# Altium schematic sheet Mechanical_Parts.SchDoc: Mechanical_Parts
size A4; Date: Not used; ApprovedBy: Not used; CheckedBy: Not used; Author: Not used; CompanyName: STMicroelectronics; DrawnBy: Not used; Engineer: Not used; Organization: Not used; Address1: Not used; Address2: Not used; Address3: Not used; Address4: Not used; DocumentNumber: 9; Revision: Not used; SheetNumber: 9; SheetTotal: 9; CurrentTime: Not used; CurrentDate: Not used; Time: Not used; DocumentFullPathAndName: Not used; DocumentName: Not used; ModifiedDate: Not used; ImagePath: Not used; ProjectName: Not used; Application_BuildNumber: Not used
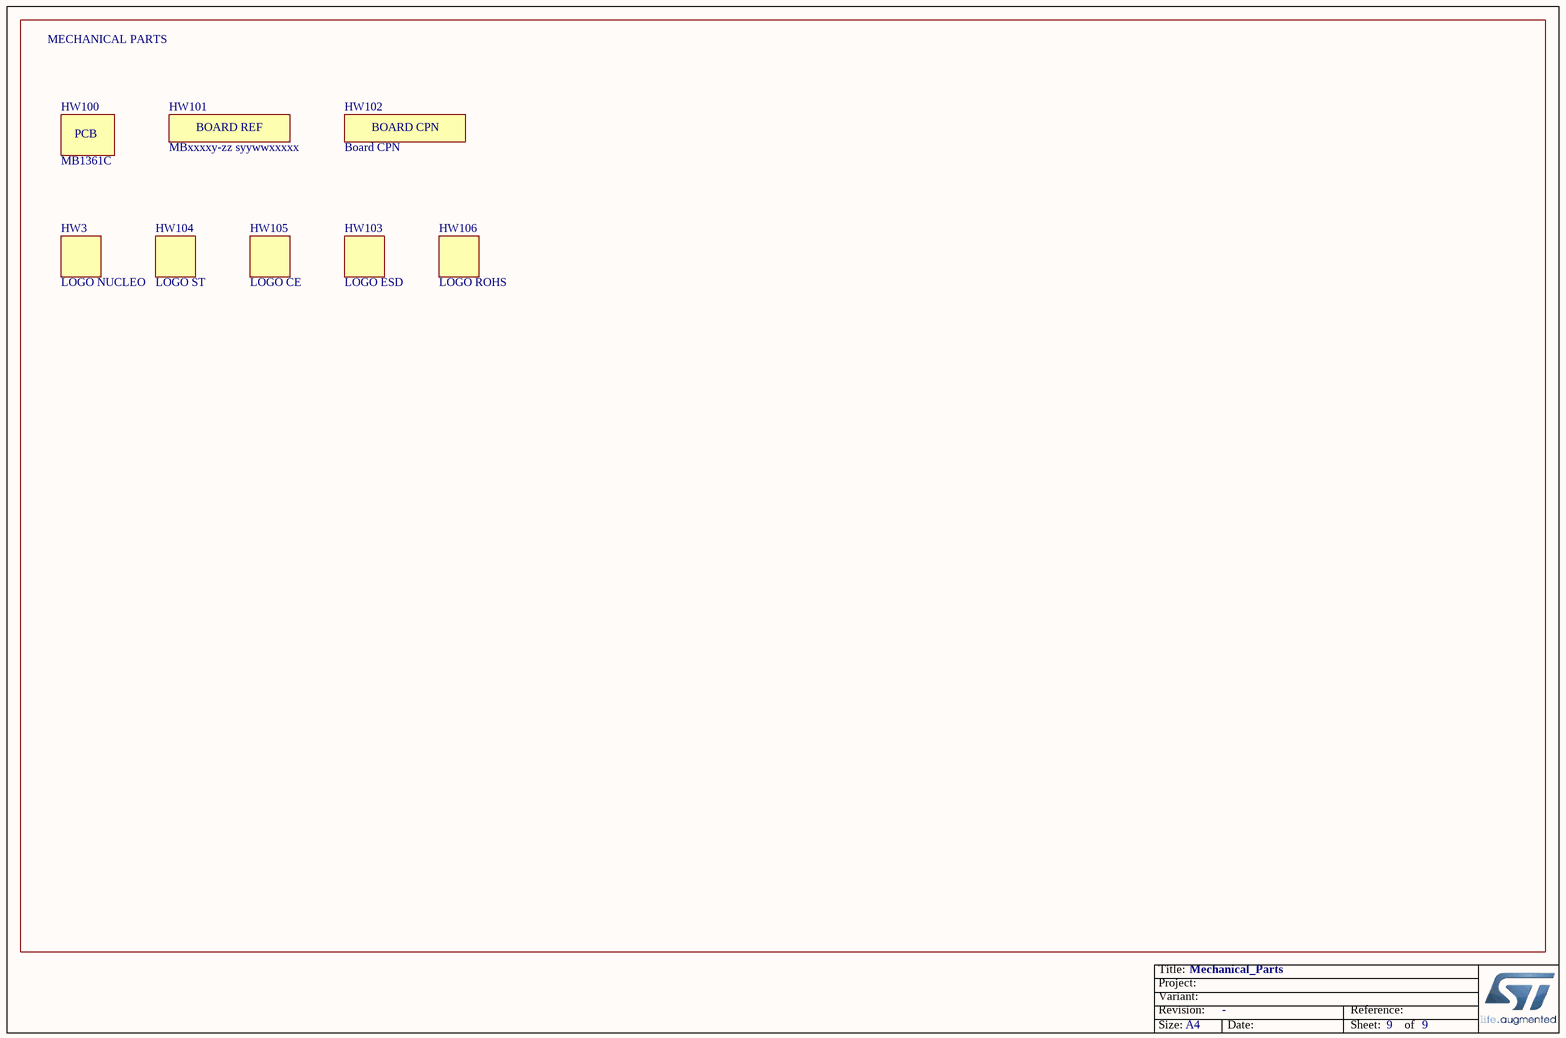
[diagram p0: Mechanical_Parts.SchDoc]

## Parts
HW3  value LOGO NUCLEO  [LOGO_NUCLEO]  (no BOM)
HW100  value MB1361C  (mechanical)
HW101  value MBxxxxy-zz syywwxxxxx  [STICKER_25X9]  (hidden comment: STICKER_BOARD_REF)  (no BOM)
HW102  value Board CPN  [STICKER_25X9]  (hidden comment: STICKER_BOARD_CPN)  (no BOM)
HW103  value LOGO ESD  [LOGO_MAIN_1]  (no BOM)
HW104  value LOGO ST  [LOGO_ST]  (no BOM)
HW105  value LOGO CE  [LOGO_CE]  (no BOM)
HW106  value LOGO ROHS  [LOGO_ROHS]  (no BOM)

## Notes on the sheet
- MECHANICAL PARTS
- Title:
- Project:
- Size:
- Revision:
- Variant:
- A4
- -
- Date:
- Reference:
- Sheet:
- of
- (in symbol MCD-00235) BOARD REF
- (in symbol MCD-00547) BOARD CPN

## Library data of the parts
HW3 = MCD-00636: NUCLEO logo footprint for PCB; Part_Type: Mechanical; Initial_Board_Reference: MB1331; Internal_Part_Number: MCD-00636; Status: Released; ECCN_US: n/a; ECCN_EU: n/a; Provided_By: n/a; ComponentLink1Description: Datasheet
HW100 = MCD-00216: PCB, xxxx for PCB ref, Y for revision; Part_Type: Mechanical; Provided_By: Subcon; Initial_Board_Reference: MB1319; Internal_Part_Number: MCD-00216; Status: Released; ECCN_US: n/a; ECCN_EU: n/a; ComponentLink1Description: Datasheet
HW101 = MCD-00235: Sticker to mention board reference + serial number; Part_Type: Mechanical; Provided_By: SUBCO; Internal_Part_Number: MCD-00235; Status: Released; Manufacturer_Part_Number: n/a; Manufacturer: n/a; ComponentLink1Description: Datasheet; ComponentLink1URL: n/a
HW102 = MCD-00547: Sticker to mention board CPN code; Part_Type: Mechanical; Provided_By: SUBCO; Internal_Part_Number: MCD-00547; Status: Released; Manufacturer_Part_Number: n/a; Manufacturer: n/a; ComponentLink1Description: Datasheet; ComponentLink1URL: NA
HW103 = MCD-00627: Hand ESD logo footprint for PCB; Part_Type: Mechanical; Initial_Board_Reference: MB1331; Internal_Part_Number: MCD-00627; Status: Released; ECCN_US: n/a; ECCN_EU: n/a; Provided_By: n/a; Manufacturer_Part_Number: n/a; Manufacturer: n/a; ComponentLink1Description: Datasheet; ComponentLink1URL: http://na
HW104 = MCD-00625: STMicroelectronics logo footprint for PCB; Part_Type: Mechanical; Initial_Board_Reference: MB1331; Internal_Part_Number: MCD-00625; Status: Released; ECCN_US: n/a; ECCN_EU: n/a; Provided_By: n/a; Manufacturer_Part_Number: n/a; Manufacturer: n/a; ComponentLink1Description: Datasheet; ComponentLink1URL: http://na
HW105 = MCD-00626: CE logo footprint for PCB; Part_Type: Mechanical; Initial_Board_Reference: MB1331; Internal_Part_Number: MCD-00626; Status: Released; ECCN_US: n/a; ECCN_EU: n/a; Provided_By: n/a; ComponentLink1Description: Datasheet
HW106 = MCD-00628: ROHS logo footprint for PCB; Part_Type: Mechanical; Initial_Board_Reference: MB1331; Internal_Part_Number: MCD-00628; Status: Released; ECCN_US: n/a; ECCN_EU: n/a; Provided_By: n/a; ComponentLink1Description: Datasheet